# EAGLE design TinyPICO (EAGLE 9.4.2)
DATE: 22-04-2019; REV: V1 P3; TITLE: TinyPICO
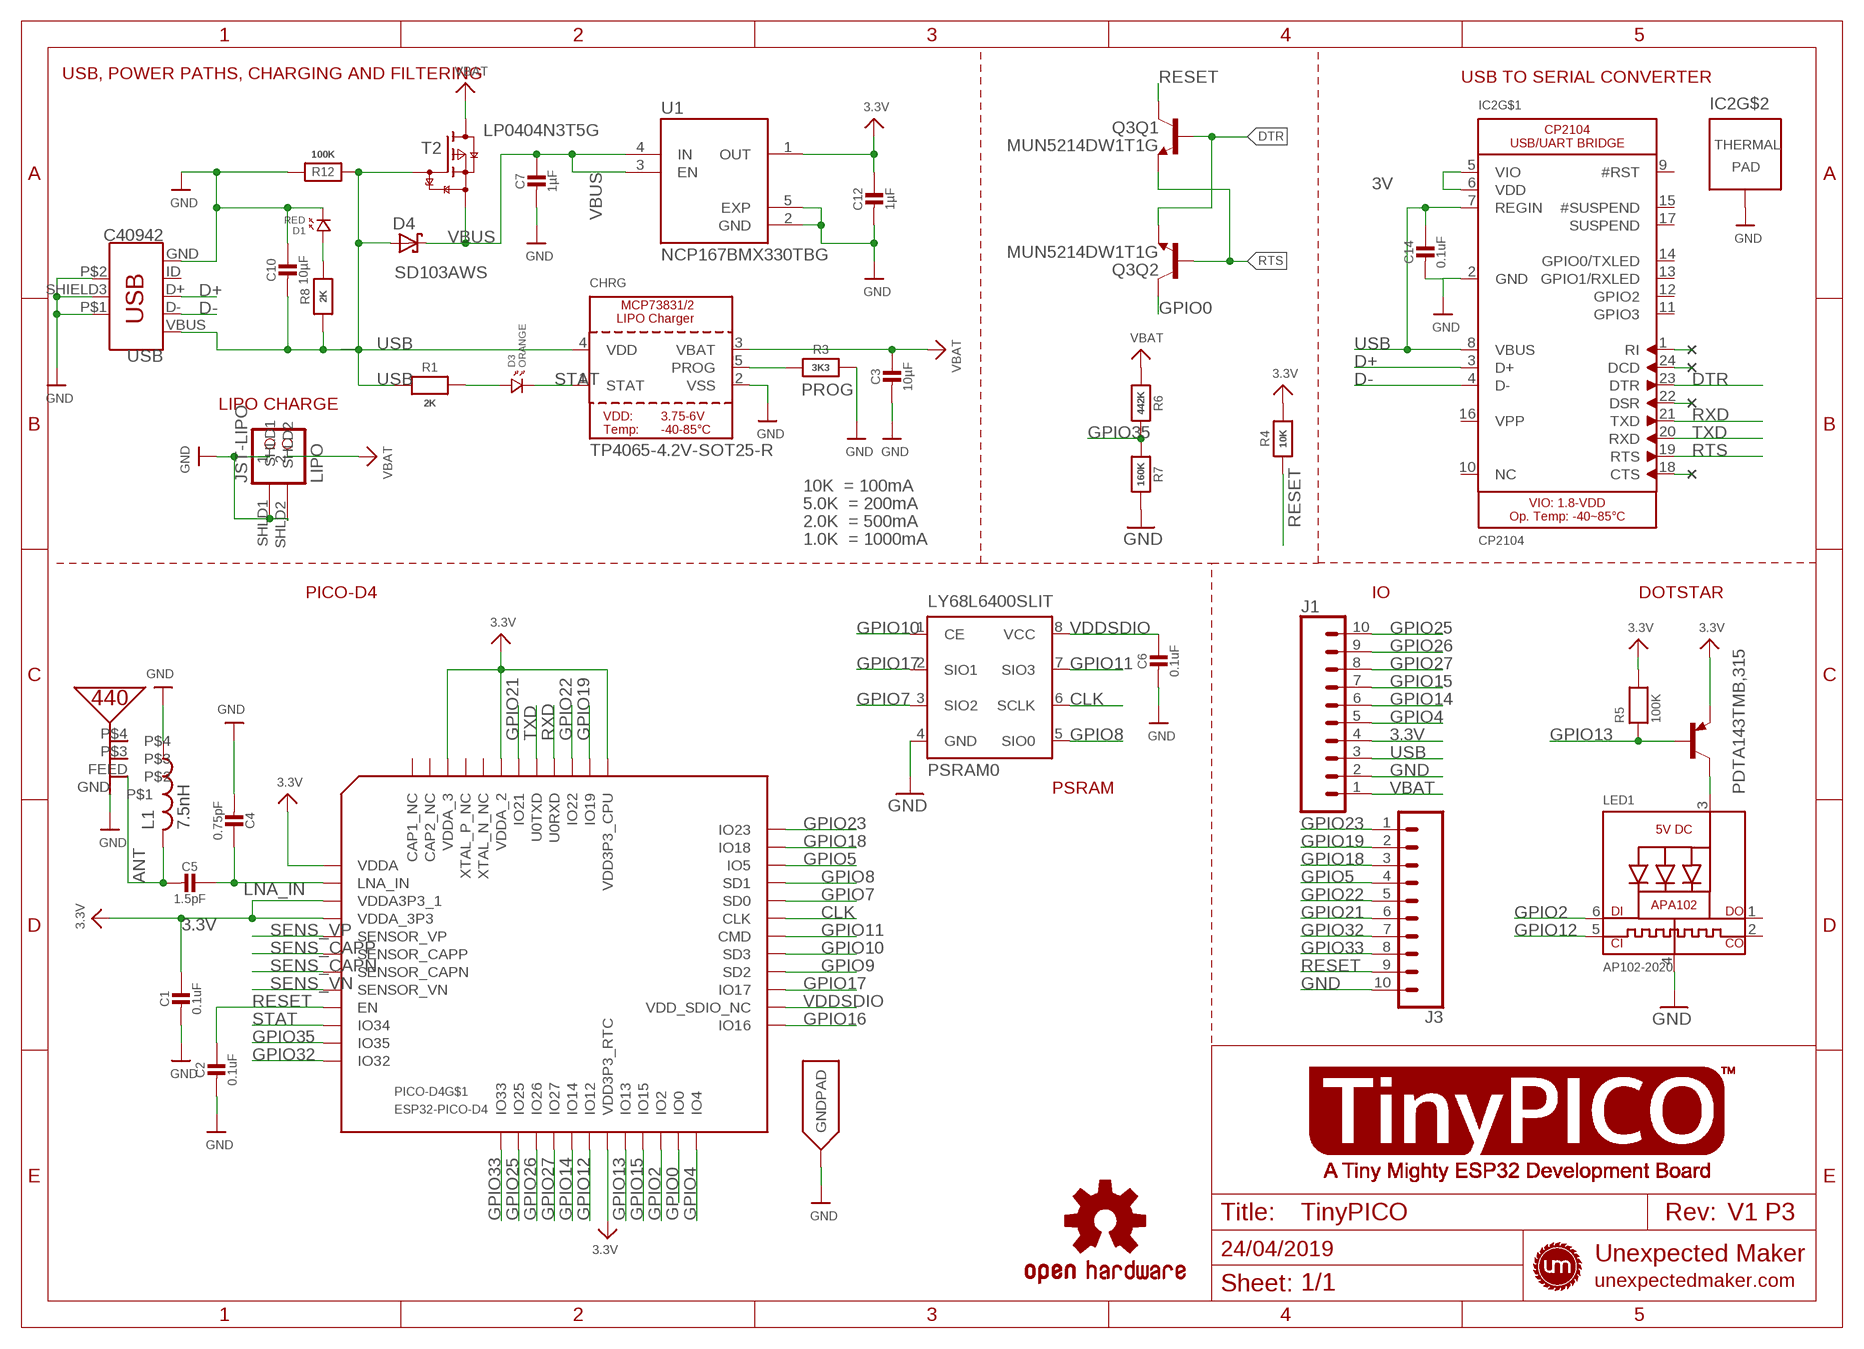
[diagram p0: schematic, sheet 1]
FRAME2 (FRAME_A4_TINYPICO): CDATE: 24/04/2019; REV: V1 P3; SHEET_NUM: 1/1; TITLE: TinyPICO

## Parts
C1  0.1uF  CAP_CERAMIC_0402MP  [_0402MP]
C2  0.1uF  CAP_CERAMIC_0402MP  [_0402MP]
C3  10µF  CAP_CERAMIC_0603MP  [_0603MP]
C4  0.75pF  CAP_CERAMIC_0402MP  [_0402MP]
C5  1.5pF  CAP_CERAMIC_0402MP  [_0402MP]
C6  0.1uF  CAP_CERAMIC_0402MP  [_0402MP]
C7  1µF  CAP_CERAMIC_0402MP  [_0402MP]
C10  10µF  CAP_CERAMIC_0603MP  [_0603MP]
C12  1µF  CAP_CERAMIC_0402MP  [_0402MP]
C14  0.1uF  CAP_CERAMIC_0402MP  [_0402MP]
CHRG  TP4065-4.2V-SOT25-R  MCP73831/2  [SOT23-5]
D1  RED  LED.0402  [0402.LED]
D3  ORANGE  LED.0402  [0402.LED]
D4  BAT60J  [SOD323_ST]
IC2  CP2104  MICROBUILDER_CP2104  [MICROBUILDER_QFN24_4MM_SMSC]
J1  TINYPICO_HEADER_10NO_SILK_PTH_FEMALE  [1X10_NO_SILK]
J3  TINYPICO_HEADER_10NO_SILK_PTH_FEMALE  [1X10_NO_SILK]
JST-LIPO  LIPO  JST_2PIN  [JSTPH2]
L1  7.5nH  INDUCTOR_0402_N  [RESC0402_N]
LED1  AP102-2020  MICROBUILDER_APA1022020  [MICROBUILDER_APA102_2020]
LOGO1  OSHW-LOGOS  [OSHW-LOGO-S]
LY68L6400SLIT  PSRAM0  [SOP8]
PDTA143TMB,315  TINYPICO-PNPAMB  [SOT883(B)]
PICO-D4  ESP32-PICO-D4  [PICO-D4-QFN48]
Q3  MUN5214DW1T1G  MBT3904DW1T1  [DUAL_NPN_SC70-6]
R1  2K  RESISTOR_0402MP  [_0402MP]
R3  3K3  RESISTOR_0402MP  [_0402MP]
R4  10K  RESISTOR_0402MP  [_0402MP]
R5  100K  RESISTOR_0402MP  [_0402MP]
R6  442K  RESISTOR_0402MP  [_0402MP]
R7  160K  RESISTOR_0402MP  [_0402MP]
R8  2K  RESISTOR_0402MP  [_0402MP]
R12  100K  RESISTOR_0402MP  [_0402MP]
T2  TINYPICO-P-FETKMB  [SOT883(B)]
U1  NCP170AMX300TCG  [VREG_NCP170AMX300TCG]
U$8  PRO-OB-440  [PRO-OB-440]
USB  C40942  TINYPICO_USB_FEMALE-SMT  [USB-B-MICRO-SMD]

## Nets
3.3V: C1.1 C12.1 J1.4 PDTA143TMB,315.2(E) PICO-D4.1(VDDA) PICO-D4.3(VDDA3P3_1) PICO-D4.4(VDDA_3P3) PICO-D4.19(VDD3P3_RTC) PICO-D4.37(VDD3P3_CPU) PICO-D4.43(VDDA_2) PICO-D4.46(VDDA_3) R4.2 R5.2 U1.1(OUT)
3V: IC2.5(VIO) IC2.6(VDD)
ANT: C5.2 L1.2 U$8.FEED
CLK: LY68L6400SLIT.6(SCLK) PICO-D4.31(CLK)
D+: IC2.3(D+) USB.D+
D-: IC2.4(D-) USB.D-
DTR: IC2.23(DTR) Q3.1(Q2:E) Q3.5(Q1:B)
GND: C1.2 C2.2 C3.2 C4.2 C6.2 C7.2 C10.1 C12.2 C14.2 CHRG.2(VSS) D1.P$2 IC2.2(GND) IC2.THERM(TP) J1.2 J3.10 JST-LIPO.1 JST-LIPO.SHLD1 JST-LIPO.SHLD2 L1.1 LED1.4(GND) LY68L6400SLIT.4(GND) PICO-D4.EXP(GNDPAD) R3.2 R7.2 R12.2 U1.2(GND) U1.5(EXP) U$8.GND USB.GND USB.P$1(SHIELD1) USB.P$2(SHIELD2) USB.SHIELD3(SHIELD)
GPIO0: PICO-D4.23(IO0) Q3.6(Q2:C)
GPIO2: LED1.6(DI) PICO-D4.22(IO2)
GPIO4: J1.5 PICO-D4.24(IO4)
GPIO5: J3.4 PICO-D4.34(IO5)
GPIO7: LY68L6400SLIT.3(SIO2) PICO-D4.32(SD0)
GPIO8: LY68L6400SLIT.5(SIO0) PICO-D4.33(SD1)
GPIO9: PICO-D4.28(SD2)
GPIO10: LY68L6400SLIT.1(CE) PICO-D4.29(SD3)
GPIO11: LY68L6400SLIT.7(SIO3) PICO-D4.30(CMD)
GPIO12: LED1.5(CKI) PICO-D4.18(IO12)
GPIO13: PDTA143TMB,315.1(B) PICO-D4.20(IO13) R5.1
GPIO14: J1.6 PICO-D4.17(IO14)
GPIO15: J1.7 PICO-D4.21(IO15)
GPIO16: PICO-D4.25(IO16)
GPIO17: LY68L6400SLIT.2(SIO1) PICO-D4.27(IO17)
GPIO18: J3.3 PICO-D4.35(IO18)
GPIO19: J3.2 PICO-D4.38(IO19)
GPIO21: J3.6 PICO-D4.42(IO21)
GPIO22: J3.5 PICO-D4.39(IO22)
GPIO23: J3.1 PICO-D4.36(IO23)
GPIO25: J1.10 PICO-D4.14(IO25)
GPIO26: J1.9 PICO-D4.15(IO26)
GPIO27: J1.8 PICO-D4.16(IO27)
GPIO32: J3.7 PICO-D4.12(IO32)
GPIO33: J3.8 PICO-D4.13(IO33)
GPIO35: PICO-D4.11(IO35) R6.2 R7.1
LNA_IN: C4.1 C5.1 PICO-D4.2(LNA_IN)
N$1: D1.P$1 R8.2
N$2: D3.P$1 R1.2
N$4: IC2.1(RI)
N$5: IC2.24(DCD)
N$6: IC2.22(DSR)
N$7: IC2.18(CTS)
N$8: LED1.3(VDD) PDTA143TMB,315.3(C)
PROG: CHRG.5(PROG) R3.1
RESET: C2.1 J3.9 PICO-D4.9(EN) Q3.3(Q1:C) R4.1
RTS: IC2.19(RTS) Q3.2(Q2:B) Q3.4(Q1:E)
RXD: IC2.21(TXD) PICO-D4.40(U0RXD)
SENS_CAPN: PICO-D4.7(SENSOR_CAPN)
SENS_CAPP: PICO-D4.6(SENSOR_CAPP)
SENS_VN: PICO-D4.8(SENSOR_VN)
SENS_VP: PICO-D4.5(SENSOR_VP)
STAT: CHRG.1(STAT) D3.P$2 PICO-D4.10(IO34)
TXD: IC2.20(RXD) PICO-D4.41(U0TXD)
USB: C10.2 C14.1 CHRG.4(VDD) D4.A IC2.7(REGIN) IC2.8(VBUS) J1.3 R1.1 R8.1 R12.1 T2.1(G) USB.VBUS
VBAT: C3.1 CHRG.3(VBAT) J1.1 JST-LIPO.2 R6.1 T2.3(D)
VBUS: C7.1 D4.C T2.2(S) U1.3(EN) U1.4(IN)
VDDSDIO: C6.1 LY68L6400SLIT.8(VCC) PICO-D4.26(VDD_SDIO_NC)
Unconnected: IC2.9(#RST) IC2.10(NC) IC2.11(GPIO3) IC2.12(GPIO2) IC2.13(GPIO1/RXLED) IC2.14(GPIO0/TXLED) IC2.15(#SUSPEND) IC2.16(VPP) IC2.17(SUSPEND) LED1.1(DO) LED1.2(CKO) PICO-D4.44(XTAL_N_NC) PICO-D4.45(XTAL_P_NC) PICO-D4.47(CAP2_NC) PICO-D4.48(CAP1_NC) U$8.P$3 U$8.P$4 USB.ID

## Notes on the sheet
- USB, POWER PATHS, CHARGING AND FILTERING | USB TO SERIAL CONVERTER
- LP0404N3T5G
- NCP167BMX330TBG
- SD103AWS
- LIPO CHARGE
- 10K  = 100mA
- 5.0K  = 200mA
- 2.0K  = 500mA
- 1.0K  = 1000mA
- PICO-D4 | IO | DOTSTAR
- PSRAM

## Library data of the parts
C1-C7 C10 C12 C14 = microbuilder:CAP_CERAMIC: Ceramic Capacitors For new designs, use the packages preceded by an '_' character since they are more reliable: The following footprints should be used on most boards: _0402 - Standard footprint for regular board layouts _0603 - Standard footprint for regular board layouts _0805 - Standard footprint for regular board layouts _1206 - Standard footprint for regular board layouts For extremely tight-pitch boards where space is at a premium, the following 'micro-pitch' footprints can be used (smaller pads, no silkscreen outline, etc.): _0402MP - Micro-pitch footprint for very dense/compact boards _0603MP - Micro-pitch footprint for very dense/compact boards _0805MP - Micro-pitch footprint for very dense/compact boards _1206MP - Micro-pitch footprint for very dense/compact boards
CHRG = microbuilder:MCP73831/2: MCP73831/2 LIPO Charger VDD: 3.75 - 6V Temp -40 - 85°C Programmable Charge Rate: 15-500mA NOTE: STAT is a tri-state logic output on the MCP73831 and an open-drain output on the MCP73832. SOT23-5 with 4.2V output and tri-state logic on STAT = MCP73831T-2ACI/OT
D1 D3 = cmonr_standardparts:LED
D4 = diode:BAT60J: Schottky barrier diode Source: www.st.com, BAT60J.pdf
IC2 = CP2104:MICROBUILDER_CP2104: CP2104 - USB to UART Bridge VDD Output: 3.45V
J1 J3 = UnexpectedMaker:TINYPICO_HEADER_10: Multi connection point. Often used as Generic Header-pin footprint for 0.1 inch spaced/style header connections On any of the 0.1 inch spaced packages, you can populate with these: Break Away Headers - Straight <https://www.sparkfun.com/products/116> (PRT-00116) Break Away Male Headers - Right Angle <https://www.sparkfun.com/products/553> (PRT-00553) Female Headers <https://www.sparkfun.com/products/115> (PRT-00115) Break Away Headers - Machine Pin <https://www.sparkfun.com/products/117> (PRT-00117) Break Away Female Headers - Swiss Machine Pin <https://www.sparkfun.com/products/743> (PRT-00743) Arduino Stackable Header - 10 Pin <https://www.sparkfun.com/products/11376> (PRT-11376) For SCREWTERMINALS and SPRING TERMINALS visit here: Screw Terimnals on SparkFun.com <https://www.sparkfun.com/search/results?term=Screw+Terminals> (5mm/3.5mm/2.54mm spacing) This device is also useful as a general connection point to wire up your design to another part of your project. Our various solder wires solder well into these plated through hole pads. Hook-Up Wire - Assortment (Stranded, 22 AWG) <https://www.sparkfun.com/products/11375> (PRT-11375) Hook-Up Wire - Assortment (Solid Core, 22 AWG) <https://www.sparkfun.com/products/11367> (PRT-11367) View the entire wire category on our website here <https://www.sparkfun.com/categories/141> Special notes: Molex polarized connector foot print use with SKU : PRT-08231 with associated crimp pins and housings. 1MM SMD Version SKU: PRT-10208 NOTES ON THE VARIANTS LOCK and LOCK_LONGPADS... This footprint was designed to help hold the alignment of a through-hole component (i.e. 6-pin header) while soldering it into place. You may notice that each hole has been shifted either up or down by 0.005 of an inch from it's more standard position (which is a perfectly straight line). This slight alteration caused the pins (the squares in the middle) to touch the edges of the holes. Because they are alternating, it causes a "brace" to hold the component in place. 0.005 has proven to be the perfect amount of "off-center" position when using our standard breakaway headers. Although looks a little odd when you look at the bare footprint, once you have a header in there, the alteration is very hard to notice. Also,if you push a header all the way into place, it is covered up entirely on the bottom side.; PROD_ID: CONN-11563
JST-LIPO = UnexpectedMaker:JST_2PIN: JST 2-Pin Right-Angle Connector PH-Series - 4UConnector: 17311 SH-Series - 4UConnector: 07278
L1 = Nordic_nRF:INDUCTOR: Generic chip inductor
LED1 = UnexpectedMaker:MICROBUILDER_APA102: APA102/DotStar Pixels VCC: 5V DC Refresh Rate: 400Hz
LOGO1 = SparkFun-Aesthetics:OSHW-LOGO: Open-Source Hardware (OSHW) Logo This logo indicates the piece of hardware it is found on incorporates a OSHW license and/or adheres to the definition of open source hardware found here: http://freedomdefined.org/OSHW
LY68L6400SLIT = UnexpectedMaker:PSRAM: H-bridge driver for brush motors Source: http://www.rohm.com/products/databook/motor/pdf/bd623x_series-e.pdf; MPN: BD6230F-E2; OC_FARNELL: 1716264; OC_NEWARK: 15R0529
PDTA143TMB,315 = UnexpectedMaker:TINYPICO-PNP: PNP general purpose transistors AAL Eindhoven MK
PICO-D4 = UnexpectedMaker:ESP32-PICO-D4
Q3 = UnexpectedMaker:MBT3904DW1T1: MBT3904DW1 Dual NPN Transistors The MBT3904W1 puts two general purpose 3904 NPN transistors in a single package. Datasheet <http://www.onsemi.com/pub_link/Collateral/MBT3904DW1T1-D.PDF>; PROD_ID: TRANS-13337
R1 R3-R8 R12 = microbuilder:RESISTOR: Resistors 0402 - 0402 Surface Mount Package 22 Ohm 1% 1/16W [Digikey: 311-22.0LRTR-ND] 33 Ohm 5% 1/16W 1.0K 5% 1/16W 1.5K 5% 1/16W 2.0K 1% 1/16W 10.0K 1% 1/16W [Digikey: 311-10.0KLRTR-ND] 10.0K 5% 1/16W [Digikey: RMCF0402JT10K0TR-ND] 12.1K 1% 1/16W [Digikey: 311-22.0LRTR-ND] 100.0K 5% 1/16W 0603 - 0603 Surface Mount Package 0 Ohm 1/10 Watt 1% Resistor 15 Ohm 1/10 Watt 1% Resistor 33 Ohm 1/10 Watt 1% Resistor 49.9 Ohm 1/10 Watt 1% Resistor 100 Ohm 1/10 Watt 1% Resistor 150 Ohm 1/10 Watt 1% Resistor 240 Ohm 1/10 Watt 1% Resistor 390 Ohm 1/10 Watt 1% Resistor 560 Ohm 1/10 Watt 1% Resistor 680 Ohm 1/10 Watt 1% Resistor 750 Ohm 1/10 Watt 1% Resistor 1.0K Ohm 1/10 Watt 1% Resistor 1.5K Ohm 1/10 Watt 1% Resistor 2.0K Ohm 1/10 Watt 1% Resistor 2.2K Ohm 1/10 Watt 1% Resistor 3.3K Ohm 1/10 Watt 1% Resistor 4.7K Ohm 1/10 Watt 1% Resistor 10.0K Ohm 1/10 Watt 1% Resistor 12.0K Ohm 1/10 Watt 1% Resistor 12.1K Ohm 1/10 Watt 1% Resistor 20.0K Ohm 1/10 Watt 1% Resistor 33.0K Ohm 1/10 Watt 1% Resistor 100.0K Ohm 1/10 Watt 1% Resistor 0805 - 0805 Surface Mount Package 0 Ohm 1/8 Watt 1% Resistor 33 Ohm 1/8 Watt 1% Resistor 100 Ohm 1/8 Watt 1% Resistor 150 Ohm 1/8 Watt 1% Resistor 200 Ohm 1/8 Watt 1% Resistor 240 Ohm 1/8 Watt 1% Resistor 330 Ohm 1/8 Watt 1% Resistor 390 Ohm 1/8 Watt 1% Resistor 470 Ohm 1/8 Watt 1% Resistor 1.0K Ohm 1/8 Watt 1% Resistor 1.5K Ohm 1/8 Watt 1% Resistor 2.0K Ohm 1/8 Watt 1% Resistor 4.7K Ohm 1/8 Watt 1% Resistor 5.1K Ohm 1/8 Watt 1% Resistor 5.6K Ohm 1/8 Watt 1% Resistor 10.0K Ohm 1/8 Watt 1% Resistor 22.0K Ohm 1/8 Watt 1% Resistor 33.0K Ohm 1/8 Watt 1% Resistor 100K Ohm 1/8 Watt 1% Resistor 1206 - 1206 Surface Mount Package 2012 - 2010 Surface Mount Package 0.11 Ohm 1/2 Watt 1% Resistor - Digikey: RHM.11UCT-ND
T2 = UnexpectedMaker:TINYPICO-P-FET: 50 V, 150 mA P-channel Trench MOSFET P-channel enhancement mode Field-Effect Transistor (FET) in a small Surface-Mounted Device (SMD) plastic package using Trench MOSFET technology. AAL Eindhoven MK
U1 = NCP170AMX300TCG:NCP170AMX300TCG: Fixed LDO Voltage Regulator, 2.2V to 5.5V, 190mV Dropout, 3Vout, 150mAout, XDFN-4; AVAILABILITY: Unavailable; DESCRIPTION: Fixed LDO Voltage Regulator, 2.2V to 5.5V, 190mV Dropout, 3Vout, 150mAout, XDFN-4; MF: ON Semiconductor; MP: NCP170AMX300TCG; PACKAGE: XDFN-4 ON Semiconductor; PRICE: None
U$8 = UnexpectedMaker:PRO-OB-440
USB = UnexpectedMaker:TINYPICO_USB: USB Type Micro-B Connector Male/female and PTH/SMT variants SparkFun Products: SparkFun microB USB Breakout <https://www.sparkfun.com/products/12035> SparkFun USB microB Plug Breakout <https://www.sparkfun.com/products/10031> SparkFun ESP8266 Thing <https://www.sparkfun.com/products/13231>; PROD_ID: CONN-11752

## Board
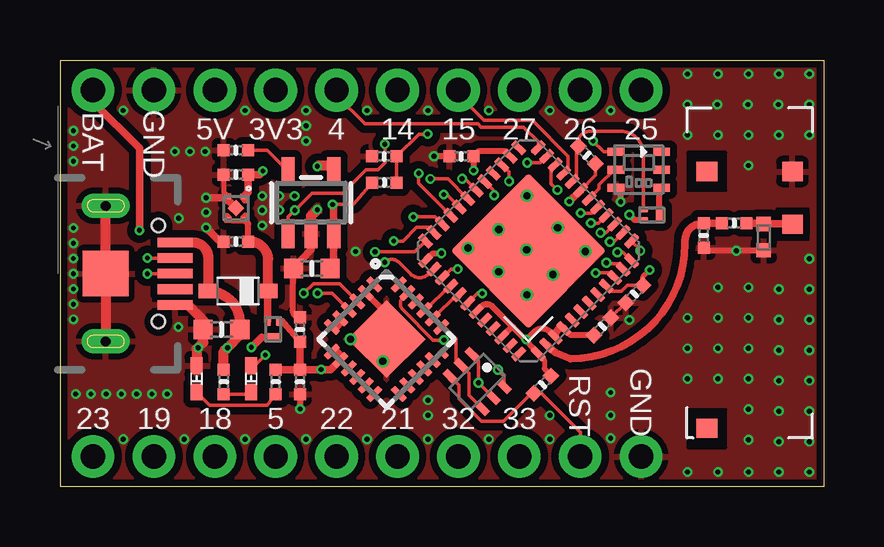
[diagram p1: board, top side]
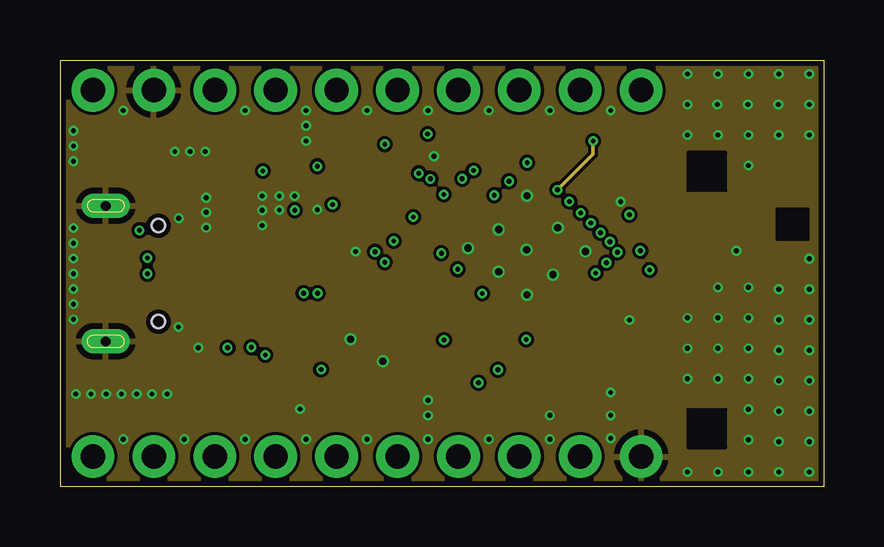
[diagram p2: board, inner layer GND]
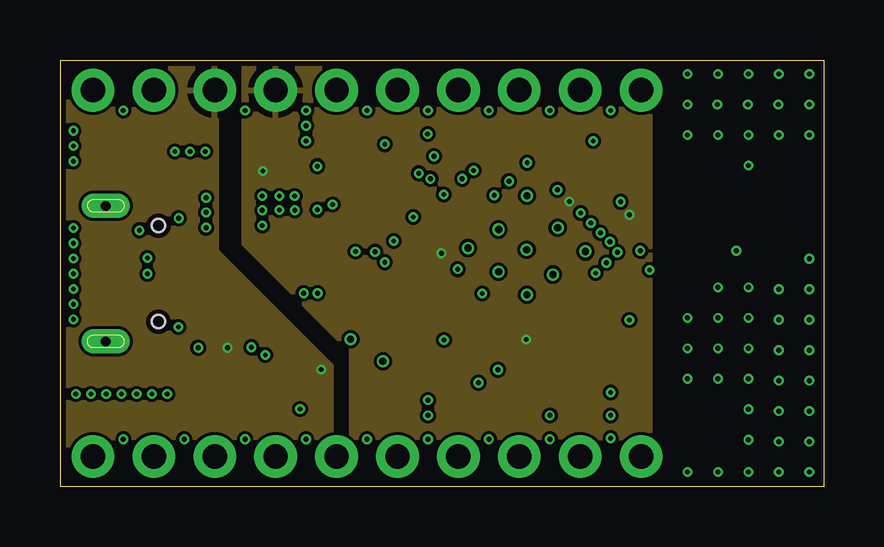
[diagram p3: board, inner layer 3.3V]
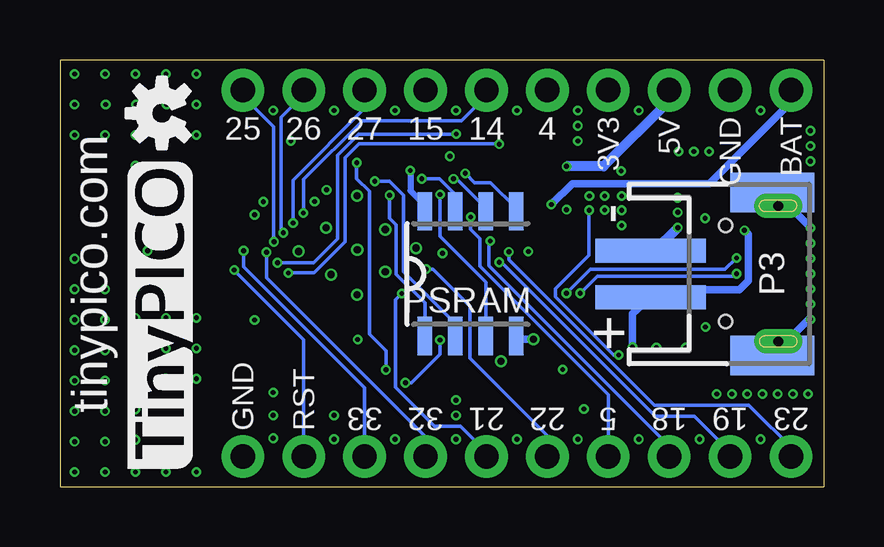
[diagram p4: board, bottom side, seen from below]

Size 31.85 x 17.78 mm. Coordinates in mm from the lower left corner, seen from the top.
Outline: 31.85,0 0,0 0,17.78 31.85,17.78 31.85,0
Copper layers (1+2*15+16): Top 0.035mm / dielectric 0.18mm / GND 0.017mm / dielectric 1.12mm / 3.3V 0.017mm / dielectric 0.18mm / Bottom 0.035mm
Design rules "UnexpectedMaker_JLCPCB 4 Layer Tight": minimum track width 5mil, minimum drill 7mil, track to track 5mil, track to pad 5mil, pad to pad 5mil, via to via 5mil, smd to smd 5mil, copper to edge 9mil, drill to drill 6mil, minimum pad ring 4mil, minimum via ring 4mil, stop-mask expansion 1.25mil, vias tented up to drill 12mil, thermal gap 10mil

### Footprints (pad centres in the part's own frame; a part is rotated, then mirrored left to right if it is on the bottom)
_0402MP = smd 0.5 x 0.5: 1 -0.508,0; 2 0.508,0
_0603MP = smd 0.8 x 0.8: 1 -0.762,0; 2 0.762,0
SOT23-5 = smd 0.55 x 1.2: 1 -0.95,-1.3; 2 0,-1.3; 3 0.95,-1.3; 4 0.95,1.3; 5 -0.95,1.3
0402.LED = smd 0.7 x 0.5: P$1 -0.55,0; P$2 0.55,0
SOD323_ST = smd 0.8 x 0.6: A 1.25,0; C -1.25,0
MICROBUILDER_QFN24_4MM_SMSC = smd 0.737 x 0.28: 1 -1.968,1.25; 2 -1.968,0.75; 3 -1.968,0.25; 4 -1.968,-0.25; 5 -1.968,-0.75; 6 -1.968,-1.25; 13 1.968,-1.25; 14 1.968,-0.75; 15 1.968,-0.25; 16 1.968,0.25; 17 1.968,0.75 | smd 0.28 x 0.737: 7 -1.25,-1.968; 8 -0.75,-1.968; 9 -0.25,-1.968; 10 0.25,-1.968; 11 0.75,-1.968; 12 1.25,-1.968; 19 1.25,1.968; 20 0.75,1.968; 21 0.25,1.968; 22 -0.25,1.968; 23 -0.75,1.968; 24 -1.25,1.968 | smd 0.457 x 0.28: 18 2.095,1.25 | smd 2.286 x 2.286: THERM 0,0
1X10_NO_SILK = drill 1.016 pad 1.778: 1 0,0; 2 2.54,0; 3 5.08,0; 4 7.62,0; 5 10.16,0; 6 12.7,0; 7 15.24,0; 8 17.78,0; 9 20.32,0; 10 22.86,0
JSTPH2 = smd 1 x 4.6: 1 -0.965,-3.607; 2 0.965,-3.607 | smd 1.651 x 3.505: SHLD1 -3.4,1.473; SHLD2 3.4,1.473
RESC0402_N = smd 0.6 x 0.6: 1 -0.55,0; 2 0.55,0
MICROBUILDER_APA102_2020 = smd 0.7 x 0.35: 1 -0.95,-0.75; 2 -0.95,0; 3 -0.95,0.75; 4 0.95,0.75; 5 0.95,0; 6 0.95,-0.75
SOP8 = smd 0.6 x 1.6: 1 -1.905,-2.6; 2 -0.635,-2.6; 3 0.635,-2.6; 4 1.905,-2.6; 5 1.905,2.6; 6 0.635,2.6; 7 -0.635,2.6; 8 -1.905,2.6
SOT883(B) = smd 0.4 x 0.25: 1 -0.35,0.225; 2 -0.35,-0.225 | smd 0.4 x 0.7: 3 0.35,0
PICO-D4-QFN48 = smd 0.66 x 0.3: 1 -3.327,2.75; 2 -3.327,2.25; 3 -3.327,1.75; 4 -3.327,1.25; 5 -3.327,0.75; 6 -3.327,0.25; 7 -3.327,-0.25; 8 -3.327,-0.75; 9 -3.327,-1.25; 10 -3.327,-1.75; 11 -3.327,-2.25; 12 -3.327,-2.75; 25 3.327,-2.75; 26 3.327,-2.25; 27 3.327,-1.75; 28 3.327,-1.25; 29 3.327,-0.75; 30 3.327,-0.25; 31 3.327,0.25; 32 3.327,0.75; 33 3.327,1.25; 34 3.327,1.75; 35 3.327,2.25; 36 3.327,2.75 | smd 0.3 x 0.66: 13 -2.75,-3.327; 14 -2.25,-3.327; 15 -1.75,-3.327; 16 -1.25,-3.327; 17 -0.75,-3.327; 18 -0.25,-3.327; 19 0.25,-3.327; 20 0.75,-3.327; 21 1.25,-3.327; 22 1.75,-3.327; 23 2.25,-3.327; 24 2.75,-3.327; 37 2.75,3.327; 38 2.25,3.327; 39 1.75,3.327; 40 1.25,3.327; 41 0.75,3.327; 42 0.25,3.327; 43 -0.25,3.327; 44 -0.75,3.327; 45 -1.25,3.327; 46 -1.75,3.327; 47 -2.25,3.327; 48 -2.75,3.327 | smd 4.572 x 4.572: EXP 0,0
DUAL_NPN_SC70-6 = smd 0.3 x 0.66: 1 -0.65,-0.92; 2 0,-0.92; 3 0.65,-0.92; 4 0.65,0.92; 5 0,0.92; 6 -0.65,0.92
VREG_NCP170AMX300TCG = smd 0.152 x 0.152: 1 -0.45,0.3; 2 -0.45,-0.3; 3 0.45,-0.3; 4 0.45,0.3 | smd 0.483 x 0.483 rotated 315: 5 0,0
PRO-OB-440 = smd 0.8 x 0.86: FEED 8.9,-4.4; GND 11.1,-4.4; P$3 11.1,-0.83; P$4 0.4,-0.83
USB-B-MICRO-SMD = smd 1.45 x 0.4: D+ 2.9,0; D- 2.9,0.65; GND 2.9,-1.3; ID 2.9,-0.65; VBUS 2.9,1.3 | drill 0.4 pad 1.016 long: P$1 0,2.825; P$2 0,-2.825 | smd 1.9 x 1.9: SHIELD3 0,0 | hole 0.55: 2.2,2; 2.2,-2

### Placement (x,y rotation side)
C1  22.62,6.68 45 top
C2  23.95,8.03 225 top
C3  10.5,9.09 180 top
C4  26.84,10.46 270 top
C5  28.11,10.99 0 top
C6  16.74,13.77 180 top
C7  7.34,10.21 180 top
C10  6.74,6.55 0 top
C12  7.34,13 180 top
C14  10.01,4.37 270 top
CHRG  10.46,11.84 0 top
D1  5.69,4.5 90 top
D3  7.98,4.5 90 top
D4  7.43,8.15 180 top
IC2  13.61,6.15 315 top
J1  1.37,16.52 0 top
J3  1.37,1.26 0 top
JST-LIPO  3.62,8.86 270 bottom
L1  29.34,10.4 90 top
LED1  24.13,13.21 180 top
LOGO1  27.6,15.56 90 bottom
LY68L6400SLIT  14.73,8.88 0 bottom
PDTA143TMB,315  24.68,11.33 0 top
PICO-D4  19.53,9.83 135 top
Q3  17.4,4.38 225 top
R1  6.83,4.37 270 top
R3  7.34,14.02 180 top
R4  20.12,4.25 45 top
R5  21.97,13.82 315 top
R6  13.53,12.67 0 top
R7  13.53,13.77 180 top
R8  8.99,4.37 270 top
R12  10.01,6.55 90 top
T2  8.89,6.55 270 top
U1  7.34,11.61 270 top
U$8  26.14,2.03 90 top
USB  1.9,8.88 0 top

### Tracks (layer width: path | path; a pad name or v marks a point on that pad's centre or on a via)
3.3V  (via drill 0.2)
  Top 0.152: PICO-D4.19 22.33,12.98 R5.2
  Top 0.203: PICO-D4.1 20.19,5.28 20.19,4.92 20.48,4.64 R4.2
  Top 0.254: PICO-D4.1 19.94,5.56 19.72,5.77 19.72,5.78 19.44,6.06 arc-90 v19.44,6.14 | v19.44,6.14 19.39,6.14 19.01,6.52 | 19.01,6.52 18.86,6.68 PICO-D4.46 | v19.44,6.14 19.47,6.14 19.79,6.46 arc-90 20.43,6.46 PICO-D4.3 | v21.24,11.89 v21.23,11.89 | PICO-D4.43 17.37,7.3 17.59,7.52 arc-90 18.01,7.52 18.83,6.7 19.01,6.52 | C1.1 21.28,6.32 PICO-D4.4 | PICO-D4.37 15.24,9.42 15.54,9.72 v15.89,9.72 v15.9,9.73 | PDTA143TMB,315.2 24.2,11.1 24.2,11.11 23.96,11.11 v23.74,11.34
  Top 0.305: PICO-D4.4 20.82,6.59 20.65,6.42 PICO-D4.3 | PICO-D4.19 v21.24,11.89 | U1.1 7.85,12.27 C12.1 8.33,13 8.46,13.13 v8.46,13.16
  pour 3.3V: 7.67,18.08 7.67,10.15 12.17,5.65 12.17,-0.33 24.6,-0.33 24.6,18.08
3V
  Top 0.254: IC2.6 11.54,6.65 11.69,6.8 IC2.5
ANT
  Top 0.305: 28.63,10.97 C5.2 29.32,10.99 29.32,10.96 L1.2 30.52,10.95 U$8.FEED
  Top 0.406: 29.32,10.99 29.37,10.94
CLK  (via drill 0.2)
  Top 0.152: PICO-D4.31 16.18,12.83 v15.44,12.83
  Bottom 0.152: LY68L6400SLIT.6 14.1,11.61 15.32,12.83 v15.44,12.83
D+  (via drill 0.2)
  Top 0.152: v10.16,8.06 10.57,8.47 11.65,8.47 IC2.3 | USB.D+ v3.64,8.88
  Bottom 0.152: v3.64,8.88 3.75,8.78 9.44,8.78 v10.16,8.06
D-  (via drill 0.2)
  Top 0.152: v10.74,8.06 11.35,8.06 IC2.4 | USB.D- v3.65,9.53 v3.64,9.53
  Bottom 0.152: v3.64,9.53 3.66,9.53 4.12,9.06 9.74,9.06 v10.74,8.06
DTR  (via drill 0.2)
  Top 0.152: Q3.5 v17.45,4.33 17.45,5.25 Q3.1 | IC2.23 14.3,7.89 arc90 14.3,7.37 15.56,6.11 v16.01,6.11
  Bottom 0.152: v16.01,6.11 16.01,5.51 17.19,4.33 v17.45,4.33
GND  (via drill 0.2, 0.3)
  Top 0.152: C2.2 22.98,7.05 C1.2
  Top 0.203: C12.2 6.83,12.27 U1.2 7.04,11.91
  Top 0.254: IC2.2 13.61,7.21 IC2.THERM | C14.2 v10.01,3.24 | R12.2 arc-90 9.7,7.36 9.7,9.05 C3.2 | LED1.4 23.37,12.27 v23.37,11.87 | C6.2 v15.6,13.77 | L1.1 29.32,9.83 v28.2,9.83 26.96,9.83 C4.2
  Top 0.305: C3.2 10.46,9.87 CHRG.2 | PICO-D4.EXP 18.64,10.72 v18.29,10.72 | U1.5 7.04,11.91 6.91,12.04 v6.1,12.04 | C7.2 6.68,10.21 v6.1,10.79 | IC2.THERM 13.61,5.38 v13.46,5.23
  Top 0.406: CHRG.2 10.46,11.28 v10.73,11.54 | D1.P$2 5.69,5.73 5.71,5.76 5.97,6.02 C10.1 5.97,6.93 5.33,7.58 USB.GND | USB.P$2 USB.SHIELD3 USB.P$1 | R12.2
  Bottom 0.254: 2.04,12.26 JST-LIPO.SHLD1 | 0.64,6.97 v0.56,6.97
  Bottom 0.305: v0.56,10.78 2.04,12.26 | JST-LIPO.SHLD2 0.64,6.97 | LY68L6400SLIT.4 12.7,6.15 v12.12,6.15
  Bottom 0.406: v6.1,10.79 7.06,9.83 JST-LIPO.1
  other vias: 19.47,12.13 21.91,9.8 19.47,8 17.01,9.94 20.75,10.79 20.55,8.84 18.29,8.95 19.46,9.87 10.26,15.67 0.57,13.56 0.57,14.2 0.57,14.83 2.57,3.86 1.93,3.86 1.3,3.86 0.66,3.86 7.72,1.98 10.26,1.98 15.34,2.97 2.64,15.67 10.26,15.04 4.94,6.65 4.47,3.86 22.96,15.67 20.42,15.67 4.79,13.97 5.42,13.97 4.95,11.19 9.14,12.12 8.43,12.12 8.43,11.52 6.1,11.43 9.14,11.53 9.78,12.12 5.77,5.79 28.7,0.61 29.97,0.61 26.16,14.66 31.24,9.5 28.7,14.66 28.7,8.31 28.7,7.04 31.24,6.96 28.7,5.77 28.7,13.39 28.7,3.23 28.7,4.5 26.16,15.93 27.43,17.2 26.16,17.2 2.64,1.98 5.18,1.98 12.8,1.98 15.34,1.98 17.88,1.98 20.42,1.98 27.43,0.61 31.24,0.61 31.24,3.15 31.24,4.42 31.24,5.69 31.24,8.23 31.24,17.2 29.97,17.2 17.88,15.67 31.24,15.93 28.68,15.93 31.24,14.66 15.34,15.67 7.72,15.67 26.16,4.5 26.16,5.77 31.24,1.88 28.7,1.96 26.16,0.61 28.7,17.2 27.43,14.66 27.41,15.93 29.97,14.66 29.95,15.93 29.97,6.96 29.97,3.15 29.97,4.42 29.97,5.69 29.97,8.23 29.97,1.88 27.43,8.31 27.43,7.04 27.43,5.77 27.43,4.5 23.74,6.95 3.2,3.86 3.84,3.86 20.42,2.97 15.34,3.61 12.8,15.67 22.96,3.92 22.96,2.97 22.96,2.02 26.16,7.04 0.56,10.15 0.56,9.51 0.56,8.88 0.56,8.24 0.56,7.61 8.43,10.88 6.06,13.97 10.26,14.4 12.33,9.8
  pour GND: -0.22,18.08 -0.22,-0.33 32.49,-0.33 32.49,18.08
  pour Top (isolate 0.305): -0.85,18.1 -0.85,-0.33 32.17,-0.33 32.17,18.08 -0.84,18.08
  cutout GND: 29.88,11.59 29.88,10.3 31.2,10.3 31.2,11.59
  cutout GND: 26.17,13.93 26.17,12.34 27.76,12.34 27.76,13.93
GND2
  cutout GND: 26.17,3.21 26.17,1.63 27.76,1.63 27.76,3.21
GND4
  cutout Top: 26.17,13.93 26.17,12.34 27.76,12.34 27.76,13.93
GND6
  cutout Top: 26.17,3.21 26.17,1.63 27.76,1.63 27.76,3.21
GND8
  cutout Top: 29.88,11.59 29.88,10.3 31.2,10.3 31.2,11.59
GPIO0  (via drill 0.2)
  Top 0.152: Q3.6 18.51,4.6 18.25,4.86 v18.26,4.88 | PICO-D4.23 20.02,13.5 v19.48,13.5
  Bottom 0.152: v19.48,13.5 19.48,12.84 18.95,12.31 18.95,6.34 18.26,5.66 v18.26,4.88
GPIO2  (via drill 0.2)
  Top 0.152: PICO-D4.22 20.55,13.32 20.55,13.31 20.48,13.24 20.48,12.63 v20.74,12.37 | LED1.6 22.67,13.96 v22.22,14.4
  GND 0.152: v22.22,14.4 22.22,13.86 v20.74,12.37
GPIO4
  Top 0.152: PICO-D4.24 19.94,14.37 19.33,14.98 17.55,14.98 17.42,15.11 12.71,15.11 11.53,16.29 J1.5
GPIO5  (via drill 0.2)
  Top 0.152: PICO-D4.34 15.64,11.24 v14.73,11.24
  Bottom 0.152: J3.4 8.99,3.83 14.34,9.18 14.34,10.33 14.73,10.72 v14.73,11.24
GPIO7  (via drill 0.2)
  Top 0.152: PICO-D4.32 16.12,12.18 v16,12.18
  Bottom 0.152: v16,12.18 16,10.43 14.1,8.52 LY68L6400SLIT.3
GPIO8  (via drill 0.2)
  Top 0.152: v14.95,13.06 14.95,12.64 PICO-D4.33
  Bottom 0.152: v14.95,13.06 14.57,12.67 13.9,12.67 12.83,11.59 LY68L6400SLIT.5
GPIO10  (via drill 0.2)
  Top 0.152: PICO-D4.29 18.11,12.32 v18.11,12.14
  Bottom 0.152: LY68L6400SLIT.1 16.64,7.66 17.83,8.86 17.83,10.91 18.11,11.18 v18.11,12.14
GPIO11  (via drill 0.2)
  Top 0.152: v16.77,12.83 16.89,12.83 PICO-D4.30
  Bottom 0.152: v16.77,12.83 16.04,12.83 15.37,12.16 LY68L6400SLIT.7
GPIO12
  Top 0.152: PICO-D4.18 22.47,12.42 22.47,12.57 23.11,13.21
  Top 0.203: LED1.5 23.11,13.21
GPIO13
  Top 0.152: PDTA143TMB,315.1 24.33,13.86 arc90 23.38,14.81 22.06,14.81 arc90 21.61,14.35 R5.1 21.53,14.09 21.53,12.88 PICO-D4.20
GPIO14  (via drill 0.2)
  Top 0.152: v21.7,11.4 22.01,11.4 22.17,11.4 PICO-D4.17
  Bottom 0.152: J1.6 14.07,16.29 15.12,15.25 19.25,15.25 21.69,12.8 21.69,11.42 v21.7,11.4
GPIO15
  Top 0.152: J1.7 16.61,16.32 17.67,15.26 19.69,15.26 21.17,13.78 21.17,13.22 21.02,13.07 PICO-D4.21
GPIO17  (via drill 0.2)
  Top 0.152: PICO-D4.27 18.72,13.11 v18.72,12.72
  Bottom 0.152: v18.72,12.72 18.11,12.72 17.54,12.15 17.54,8.96 15.37,6.79 LY68L6400SLIT.2
GPIO18  (via drill 0.2)
  Top 0.152: v13.91,10.24 14.29,10.24 14.87,10.81 15.37,10.81 PICO-D4.35
  Bottom 0.152: J3.3 6.45,1.69 13.96,9.2 13.96,10.19 v13.91,10.24
GPIO19  (via drill 0.2)
  Top 0.152: PICO-D4.38 15.39,8.87 arc-90 14.61,8.87 14.13,9.35 arc90 v13.54,9.35
  Bottom 0.152: J3.2 3.91,1.43 5.41,2.93 7.02,2.93 13.44,9.35 v13.54,9.35
GPIO21  (via drill 0.2)
  Top 0.152: v17.6,8.05 arc90 17.4,8.05 PICO-D4.42
  Bottom 0.152: J3.6 14.07,1.43 15.16,2.53 16.24,2.53 17.85,4.14 17.85,7.8 v17.6,8.05
GPIO22  (via drill 0.2)
  Top 0.152: v16.59,9.07 16.31,9.07 15.95,8.71 PICO-D4.39
  Bottom 0.152: J3.5 11.53,2.12 14.76,5.35 14.76,7.53 16.3,9.07 v16.59,9.07
GPIO23  (via drill 0.2)
  Top 0.152: v13.14,9.78 14.78,9.78 PICO-D4.36
  Bottom 0.152: J3.1 1.18,1.45 3.12,3.39 7.07,3.39 13.14,9.45 v13.14,9.78
GPIO25  (via drill 0.2)
  Top 0.152: PICO-D4.14 23.09,10.2 v22.93,10.2
  Bottom 0.152: v22.93,10.2 v22.94,10.21 22.94,15 24.23,16.29 J1.10
GPIO26  (via drill 0.2)
  Top 0.152: PICO-D4.15 22.76,10.58 v22.54,10.58
  Bottom 0.152: v22.54,10.58 22.64,10.69 22.64,15.4 21.69,16.34 J1.9
GPIO27  (via drill 0.2)
  Top 0.152: PICO-D4.16 22.46,10.98 v22.14,10.98
  Bottom 0.152: J1.8 19.15,15.76 22.14,12.78 v22.14,10.98
GPIO32  (via drill 0.2)
  Top 0.152: PICO-D4.12 23.81,9.42 23.47,9.77 v23.24,9.77
  Bottom 0.152: v23.24,9.77 23.24,8.71 16.61,2.08 J3.7
GPIO33  (via drill 0.2)
  Top 0.152: v24.19,9.83 24.19,9.87 PICO-D4.13
  Bottom 0.152: J3.8 19.15,4.13 24.19,9.17 v24.19,9.83
GPIO35  (via drill 0.2)
  Top 0.152: v22.78,9.33 22.82,9.3 23.25,9.3 PICO-D4.11 | v15.33,14.69 14.96,14.69 R7.1 R6.2
  Bottom 0.152: v22.78,9.33 21.29,9.33 20.28,10.34 20.28,13.82 19.41,14.69 v15.33,14.69
LNA_IN
  Top 0.305: PICO-D4.2 20.32,5.89 20.45,5.76 20.69,5.58 21.28,5.34 arc90 26.06,10.11 26.06,10.28 arc-90 26.73,10.95 26.81,10.95 C4.1 26.85,10.99 C5.1
N$1
  Top 0.152: D1.P$1 6.24,3.39 8.62,3.39 R8.2
N$2
  Top 0.152: R1.2 7.89,3.86 D3.P$1
N$8
  Top 0.254: PDTA143TMB,315.3 24.98,11.38 24.98,12.36 LED1.3
PROG
  Top 0.152: R3.1 8.63,14.02 CHRG.5
RESET  (via drill 0.2)
  Top 0.152: PICO-D4.9 22.99,8.14 23.4,8.14 23.65,8.39 C2.1 | Q3.3 16.64,4.22 16.64,3.67 17.58,2.73 18.49,2.73 19.65,3.89 R4.1 20.07,3.89 21.69,2.27 J3.9
  Top 0.203: v24.59,9.03 24.31,8.75 C2.1
  Bottom 0.152: v24.59,9.03 21.69,6.13 J3.9
RTS
  Top 0.152: IC2.19 16.03,6.65 16.52,6.17 16.52,5.26 Q3.2 17.04,4.74 17.04,3.81 17.05,3.81 Q3.4
RXD
  Top 0.152: PICO-D4.40 16.24,8.36 15.27,7.38 IC2.21
STAT  (via drill 0.2)
  Top 0.152: CHRG.1 9.51,11.24 v9.79,11.52 10.5,12.23 11.77,12.23 12.75,13.21 13.25,13.21 13.55,13.51 v13.55,14.27 v13.54,14.27 | PICO-D4.10 22.93,8.91 v22.33,8.91 | D3.P$2 8.12,5.05 v8.56,5.49
  Bottom 0.152: v8.56,5.49 8.76,5.49 11.2,7.92 11.2,8.24 9.79,9.65 v9.79,11.52 | v22.33,8.91 21.26,8.91 19.96,10.21 19.96,13.71 19.39,14.29 13.55,14.29 v13.54,14.27
TXD
  Top 0.152: IC2.20 15.57,7.03 16.55,8.01 PICO-D4.41
USB  (via drill 0.2)
  Top 0.254: R12.1 9.24,6.93 T2.1 | IC2.7 11.54,5.64 11.69,5.49 IC2.8
  Top 0.305: R8.1 C14.1 | R12.1 C14.1 | IC2.8 11.29,4.88 v10.89,4.88 v10.88,4.88 C14.1
  Top 0.406: CHRG.4 11.19,13.36 10.75,13.36 v10.73,13.35 | R1.1 6.83,5.64 v6.98,5.79 7.5,6.3 C10.2 7.5,6.83 arc90 D4.A 6.18,9.54 arc90 5.55,10.18 USB.VBUS
  Bottom 0.406: v10.73,13.35 9.19,13.35 6.45,16.09 J1.3
  pour 3.3V: -0.53,18.08 -0.53,-0.33 11.3,-0.33 11.3,5.02 6.52,9.8 6.52,18.08
VBAT  (via drill 0.2)
  Top 0.152: R6.1 12.23,11.76 v11.37,11.76
  Top 0.305: C3.1 11.41,9.29 CHRG.3 11.41,11.71 v11.37,11.76 | v3.31,10.68 3.31,14.1 1.37,16.04 J1.1 | v7.98,5.81 8.4,6.23 T2.3
  Bottom 0.305: v7.98,5.81 7.98,7.2 JST-LIPO.2 6.97,8.22 3.52,8.22 3.16,8.58 3.16,10.53 v3.31,10.68 | J1.1 1.37,16.04 4.78,12.63 10.49,12.63 v11.37,11.76
VBUS
  Top 0.152: U1.3 7.04,11.17 7.18,11.04 7.58,11.04 7.67,11.12 7.67,11.13
  Top 0.254: C7.1 7.85,10.95 7.67,11.13 U1.4
  Top 0.305: D4.C 8.66,8.14 T2.2
  Top 0.406: D4.C 8.68,9.51 arc90 C7.1
VDDSDIO  (via drill 0.2)
  Top 0.254: PICO-D4.26 18.55,13.99 17.47,13.99 C6.1 v17.24,13.18
  Bottom 0.254: LY68L6400SLIT.8 16.64,11.73 17.24,12.34 v17.24,13.18

### Text on the board
bPlace: - | P3 | tinypico.com | PSRAM | +
tNames: 5V | 3V3 | 4 | 14 | 15 | 27 | 26 | 25 | BAT | GND | 23 | 19 | 18 | 5 | 22 | 21 | 32 | 33 | RST | GND
bNames: BAT | GND | 5V | 3V3 | 4 | 14 | 15 | 27 | 26 | 25 | 23 | 19 | 18 | 5 | 22 | 21 | 32 | 33 | RST | GND